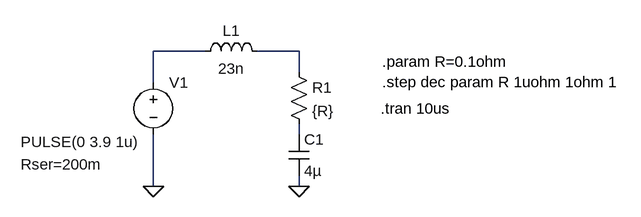
[diagram p0: schematic BatteryChargerCapacitor.asc]
BatteryChargerCapacitor.asc, the LTspice schematic file:
Version 4
SHEET 1 912 680
WIRE 144 96 64 96
WIRE 288 96 224 96
WIRE 288 128 288 96
WIRE 64 144 64 96
WIRE 288 224 288 208
WIRE 64 304 64 224
WIRE 288 304 288 288
FLAG 64 304 0
FLAG 288 304 0
SYMBOL ind 128 112 R270
WINDOW 0 32 56 VTop 0
WINDOW 3 5 56 VBottom 0
SYMATTR InstName L1
SYMATTR Value 23n
SYMBOL cap 272 224 R0
SYMATTR InstName C1
SYMATTR Value 4µ
SYMBOL res 272 112 R0
SYMATTR InstName R1
SYMATTR Value {R}
SYMBOL voltage 64 128 R0
WINDOW 3 -204 108 Left 0
WINDOW 123 0 0 Left 0
WINDOW 39 -204 142 Left 0
SYMATTR InstName V1
SYMATTR Value PULSE(0 3.9 1u)
SYMATTR SpiceLine Rser=200m
TEXT 414 184 Left 0 !.tran 10us
TEXT 416 112 Left 0 !.param R=0.1ohm\n.step dec param R 1uohm 1ohm 1

The netlist it stands for:
* BatteryChargerCapacitor.asc
L1 N001 N002 23n
C1 N003 0 4µ
R1 N002 N003 {R}
V1 N001 0 PULSE(0 3.9 1u) Rser=200m
.tran 10us
.param R=0.1ohm
.step dec param R 1uohm 1ohm 1
.backanno
.end